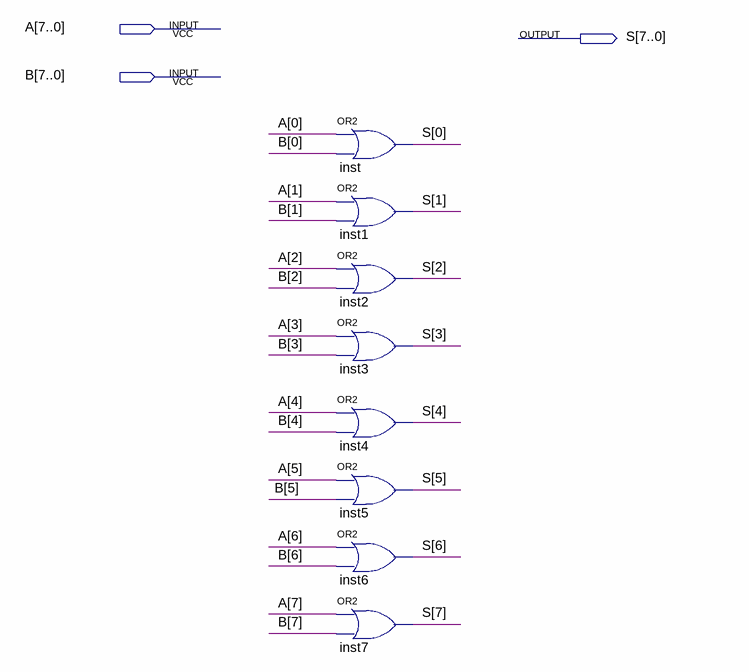
[diagram p0: schematic sheet]
// Quartus schematic OR8b.bdf as structural Verilog: 8 symbols, 3 pins
module OR8b (
  input  [7:0] A,
  input  [7:0] B,
  output [7:0] S
);

  or inst (S[0], A[0], B[0]);
  or inst1 (S[1], A[1], B[1]);
  or inst2 (S[2], A[2], B[2]);
  or inst3 (S[3], A[3], B[3]);
  or inst4 (S[4], A[4], B[4]);
  or inst5 (S[5], A[5], B[5]);
  or inst6 (S[6], A[6], B[6]);
  or inst7 (S[7], A[7], B[7]);
endmodule
